# Altium schematic sheet Sheet1.SchDoc
size A4
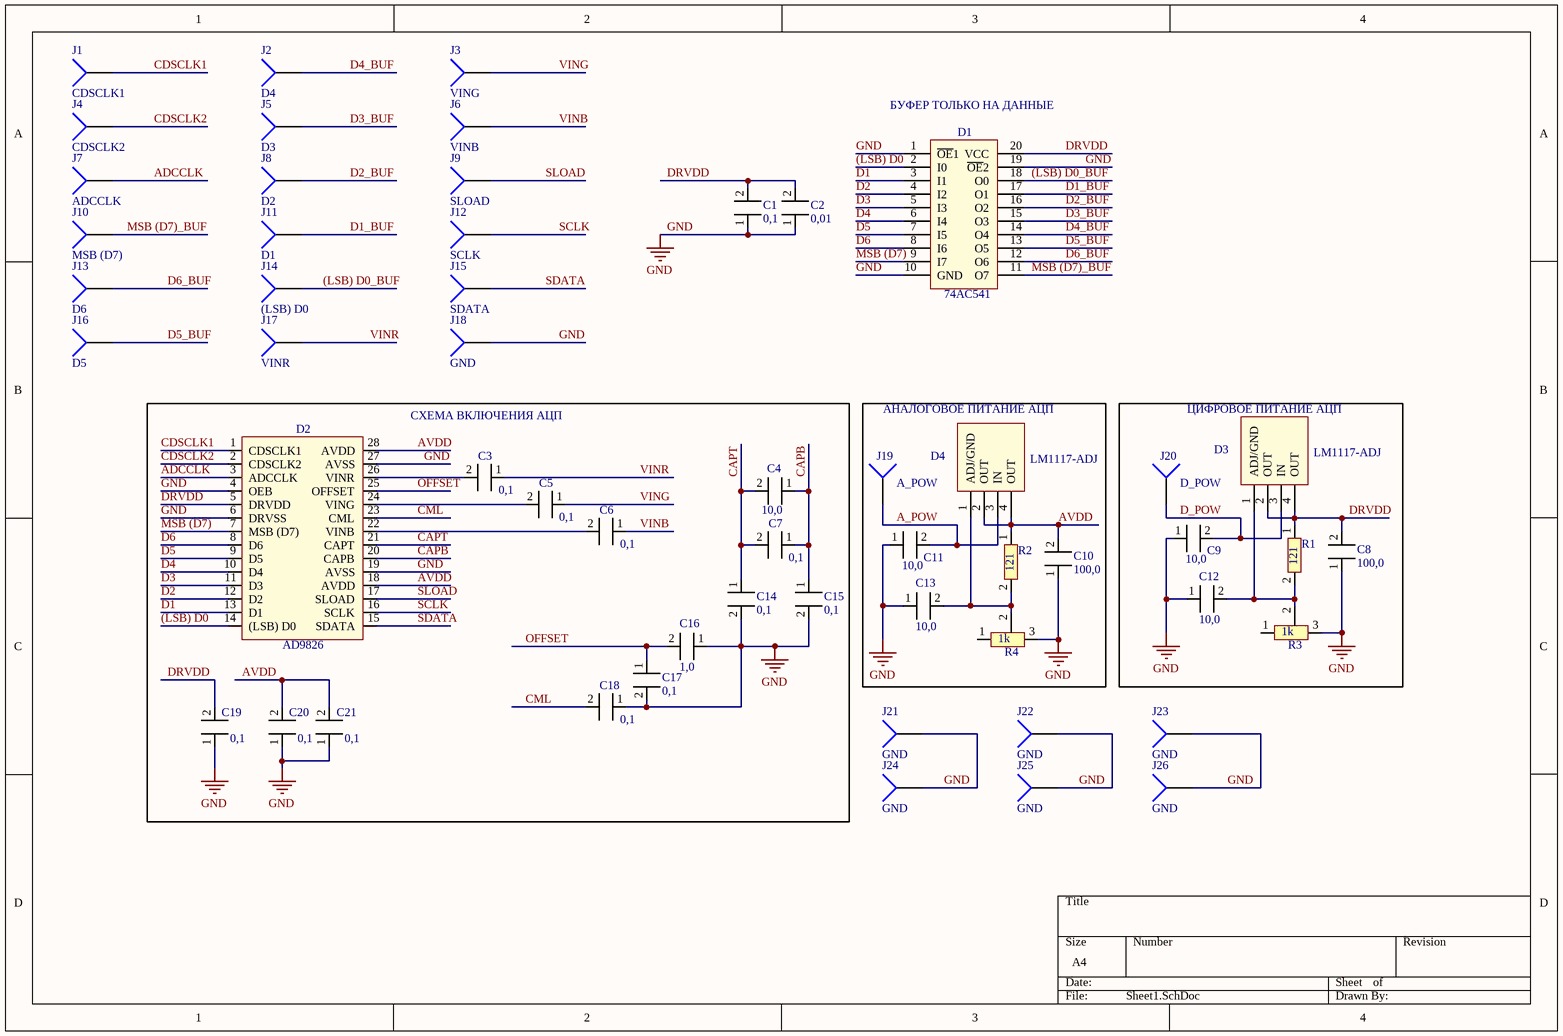
[diagram p0: Sheet1.SchDoc]

## Parts
C1  0,1  [CAP_SMALL]
C2  0,01  [CAP_SMALL]
C3  0,1  [CAP_SMALL]
C4  10,0  [CAP_SMALL]
C5  0,1  [CAP_SMALL]
C6  0,1  [CAP_SMALL]
C7  0,1  [CAP_SMALL]
C8  100,0  [Cap_BIG]
C9  10,0  [Cap_BIG]
C10  100,0  [Cap_BIG]
C11  10,0  [Cap_BIG]
C12  10,0  [Cap_BIG]
C13  10,0  [Cap_BIG]
C14  0,1  [CAP_SMALL]
C15  0,1  [CAP_SMALL]
C16  1,0  [CAP_SMALL]
C17  0,1  [CAP_SMALL]
C18  0,1  [CAP_SMALL]
C19  0,1  [CAP_SMALL]
C20  0,1  [CAP_SMALL]
C21  0,1  [CAP_SMALL]
D1  74AC541  [20S_M]
D2  AD9826  [SSOP-28]
D3  LM1117-ADJ  [SOT230P700X180-4N]
D4  LM1117-ADJ  [SOT230P700X180-4N]
J1  CDSCLK1  [PIN1]
J2  D4  [PIN1]
J3  VING  [PIN1]
J4  CDSCLK2  [PIN1]
J5  D3  [PIN1]
J6  VINB  [PIN1]
J7  ADCCLK  [PIN1]
J8  D2  [PIN1]
J9  SLOAD  [PIN1]
J10  MSB (D7)  [PIN1]
J11  D1  [PIN1]
J12  SCLK  [PIN1]
J13  D6  [PIN1]
J14  (LSB) D0  [PIN1]
J15  SDATA  [PIN1]
J16  D5  [PIN1]
J17  VINR  [PIN1]
J18  GND  [PIN1]
J19  A_POW  [PIN1]
J20  D_POW  [PIN1]
J21  GND  [PIN1]
J22  GND  [PIN1]
J23  GND  [PIN1]
J24  GND  [PIN1]
J25  GND  [PIN1]
J26  GND  [PIN1]
R1  121  [RES]
R2  121  [RES]
R3  1k  [PODSR_RES]
R4  1k  [PODSR_RES]

## Blocks framed on the sheet
СХЕМА ВКЛЮЧЕНИЯ АЦП: C3-C7 C14-C21 D2
АНАЛОГОВОЕ ПИТАНИЕ АЦП: C10 C11 C13 D4 J19 R2 R4
ЦИФРОВОЕ ПИТАНИЕ АЦП: C8 C9 C12 D3 J20 R1 R3

## Nets
GND: C1.1 C2.1 C8.1 C9.1 C10.1 C11.1 C12.1 C13.1 C14.2 C15.2 C16.1 C17.2 C18.1 C19.1 C20.1 C21.1 D1.1(~{OE}1) D1.10(GND) D1.19(~{OE}2) D2.4(OEB) D2.6(DRVSS) D2.19(AVSS) D2.27(AVSS) J18.1 J21.1 J22.1 J23.1 J24.1 J25.1 J26.1 R3.3 R4.3
(LSB) D0: D1.2(I0) D2.14((LSB)_D0)
(LSB) D0_BUF: D1.18(O0) J14.1
A_POW: C11.2 D4.3(IN) J19.1
ADCCLK: D2.3(ADCCLK) J7.1
AVDD: C10.2 C20.2 C21.2 D2.18(AVDD) D2.28(AVDD) D4.2(OUT) D4.4(OUT) R2.1
CAPB: C4.1 C7.1 C15.1 D2.20(CAPB)
CAPT: C4.2 C7.2 C14.1 D2.21(CAPT)
CDSCLK1: D2.1(CDSCLK1) J1.1
CDSCLK2: D2.2(CDSCLK2) J4.1
CML: C18.2 D2.23(CML)
D1: D1.3(I1) D2.13(D1)
D1_BUF: D1.17(O1) J11.1
D2: D1.4(I2) D2.12(D2)
D2_BUF: D1.16(O2) J8.1
D3: D1.5(I3) D2.11(D3)
D3_BUF: D1.15(O3) J5.1
D4: D1.6(I4) D2.10(D4)
D4_BUF: D1.14(O4) J2.1
D5: D1.7(I5) D2.9(D5)
D5_BUF: D1.13(O5) J16.1
D6: D1.8(I6) D2.8(D6)
D6_BUF: D1.12(O6) J13.1
D_POW: C9.2 D3.3(IN) J20.1
DRVDD: C1.2 C2.2 C8.2 C19.2 D1.20(VCC) D2.5(DRVDD) D3.2(OUT) D3.4(OUT) R1.1
MSB (D7): D1.9(I7) D2.7(MSB_(D7))
MSB (D7)_BUF: D1.11(O7) J10.1
OFFSET: C16.2 C17.1 D2.25(OFFSET)
SCLK: D2.16(SCLK) J12.1
SDATA: D2.15(SDATA) J15.1
SLOAD: D2.17(SLOAD) J9.1
VINB: C6.1 J6.1
VING: C5.1 J3.1
VINR: C3.1 J17.1
NetC3_2: C3.2 D2.26(VINR)
NetC5_2: C5.2 D2.24(VING)
NetC6_2: C6.2 D2.22(VINB)
NetC12_2: C12.2 D3.1(ADJ/GND) R1.2 R3.2
NetC13_2: C13.2 D4.1(ADJ/GND) R2.2 R4.2

Not connected (* = marked no-connect by the designer): R3 1; R4 1

## Notes on the sheet
- (near D1) БУФЕР ТОЛЬКО НА ДАННЫЕ

## Library data of the parts
C1-C7 C14-C21 = CAP_SMALL
C8-C13 = CAP_BIG
J1-J26 = Socket: LatestRevisionDate: 17-Jul-2002; LatestRevisionNote: Re-released for DXP Platform.; Publisher: Altium Limited
R1 R2 = RES
R3 R4 = RES_PODSTR